# EAGLE design AD8403_SVF (EAGLE 7.2.0)
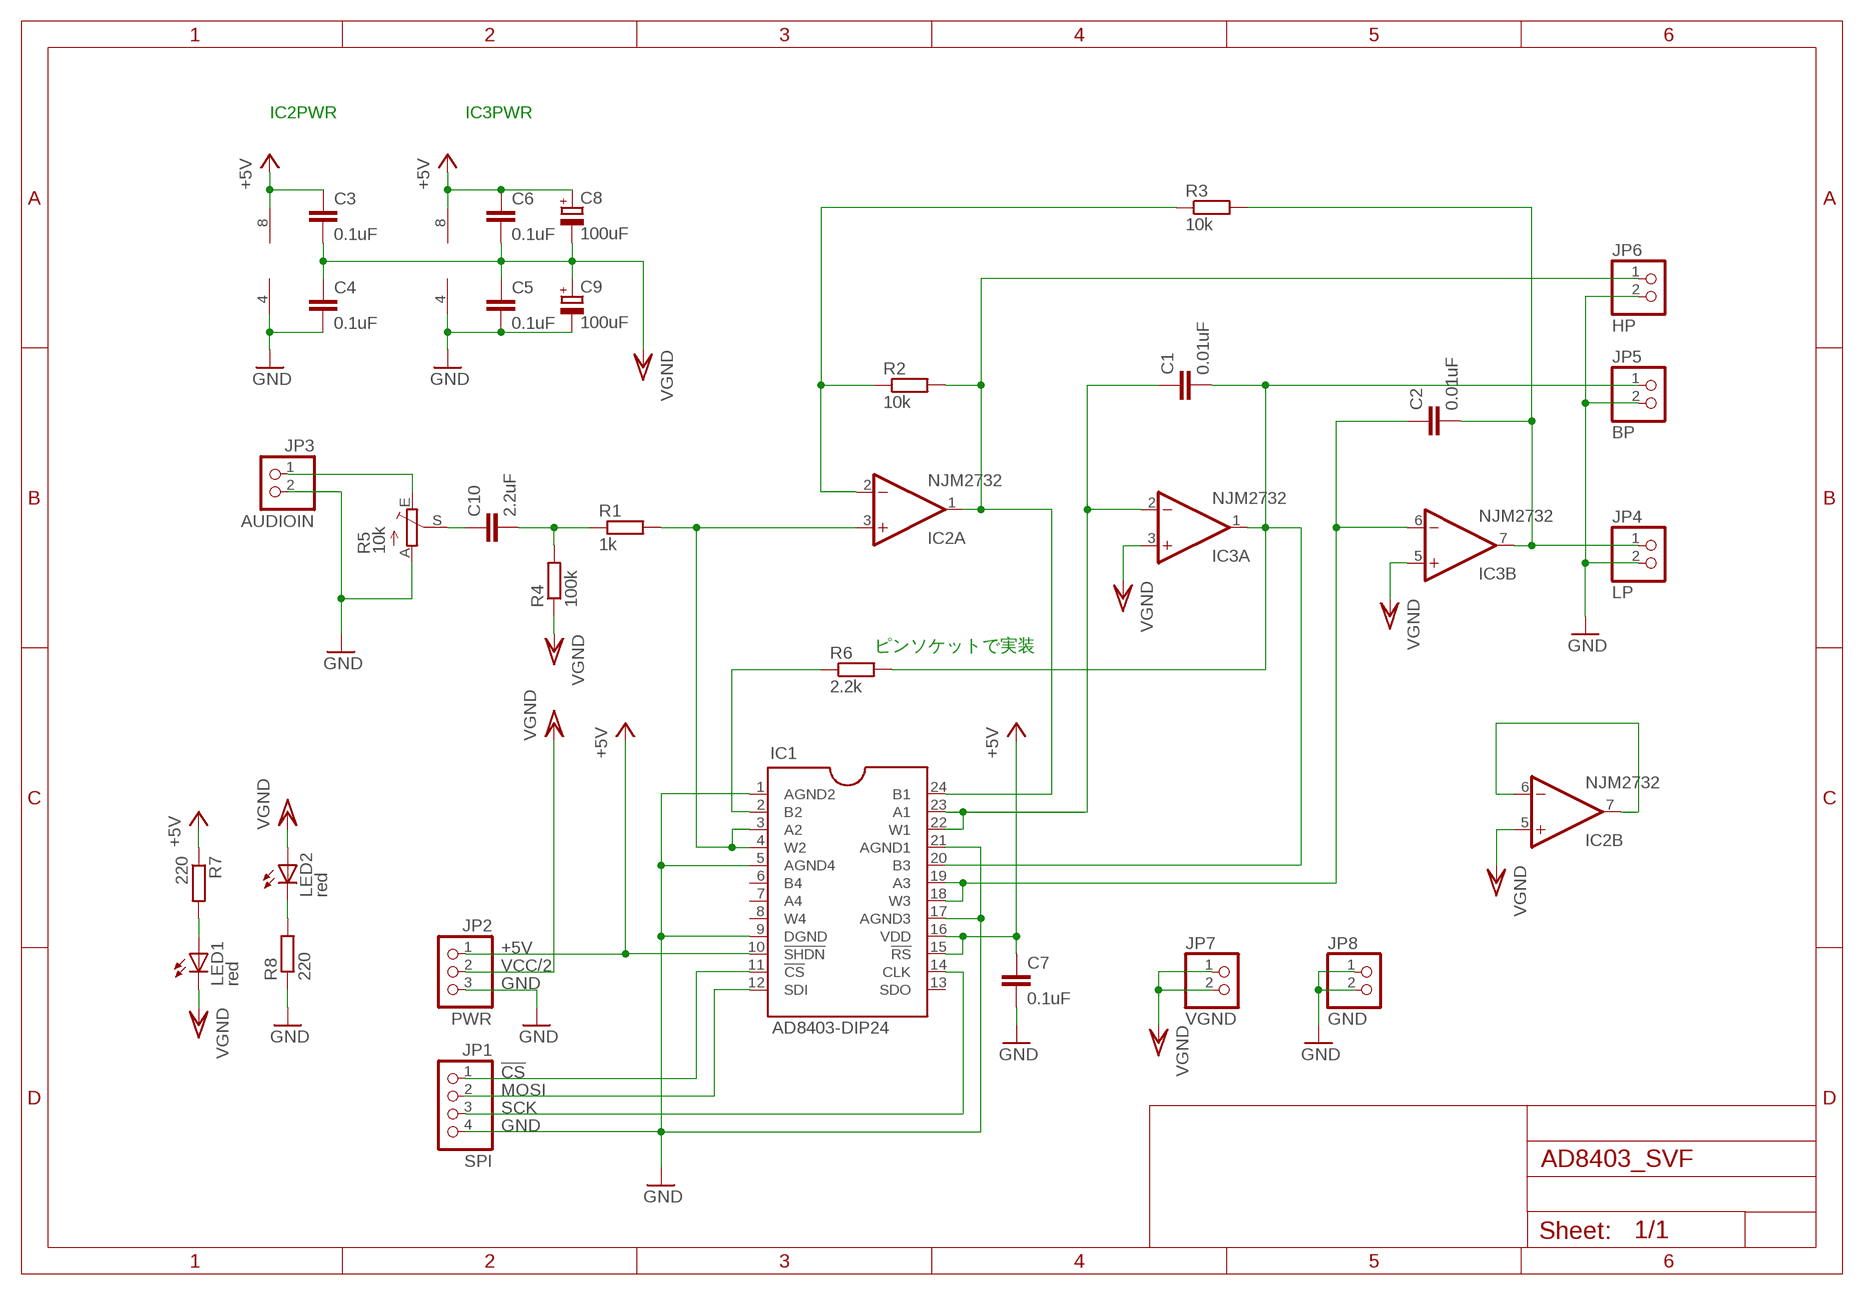
[diagram p0: schematic, sheet 1]

## Parts
C1  0.01uF  C-EU050-025X075  [C050-025X075]
C2  0.01uF  C-EU050-025X075  [C050-025X075]
C3  0.1uF  C-EU025-024X044  [C025-024X044]
C4  0.1uF  C-EU025-024X044  [C025-024X044]
C5  0.1uF  C-EU025-024X044  [C025-024X044]
C6  0.1uF  C-EU025-024X044  [C025-024X044]
C7  0.1uF  C-EU025-024X044  [C025-024X044]
C8  100uF  CPOL-EUE2.5-7  [E2,5-7]
C9  100uF  CPOL-EUE2.5-7  [E2,5-7]
C10  2.2uF  C-EU050-055X075  [C050-055X075]
IC1  AD8403-DIP24  [AD8403_DIP24]
IC2  NJM2732  LM4558N  [DIL08]
IC3  NJM2732  LM4558N  [DIL08]
JP1  SPI  PINHD-1X4  [1X04]
JP2  PWR  PINHD-1X3  [1X03]
JP3  AUDIOIN  PINHD-1X2  [1X02]
JP4  LP  PINHD-1X2  [1X02]
JP5  BP  PINHD-1X2  [1X02]
JP6  HP  PINHD-1X2  [1X02]
JP7  VGND  PINHD-1X2  [1X02]
JP8  GND  PINHD-1X2  [1X02]
LED1  red  LED3MM  [LED3MM]
LED2  red  LED3MM  [LED3MM]
R1  1k  R-EU_0207/7  [0207/7]
R2  10k  R-EU_0207/7  [0207/7]
R3  10k  R-EU_0207/7  [0207/7]
R4  100k  R-EU_0207/7  [0207/7]
R5  10k  TRIM_EU-B25P  [B25P]
R6  2.2k  R-EU_0207/7  [0207/7]
R7  220  R-EU_0204/2V  [0204V]
R8  220  R-EU_0204/2V  [0204V]

## Nets
!CS: IC1.11(!CS) JP1.1
+5V: C3.1 C6.1 C7.1 C8.+ IC1.10(!SHDN) IC1.15(!RS) IC1.16(VDD) IC2.8(P:V+) IC3.8(P:V+) JP2.1 R7.1
GND: C4.2 C5.2 C7.2 C9.- IC1.1(AGND2) IC1.5(AGND4) IC1.9(DGND) IC1.17(AGND3) IC1.21(AGND1) IC2.4(P:V-) IC3.4(P:V-) JP1.4 JP2.3 JP3.2 JP4.2 JP5.2 JP6.2 JP8.1 JP8.2 R5.A R8.1
MOSI: IC1.12(SDI) JP1.2
N$1: JP3.1 R5.E
N$2: C10.1 R5.S
N$3: IC1.3(A2) IC1.4(W2) IC2.3(A:+IN) R1.2
N$4: IC2.2(A:-IN) R2.1 R3.1
N$5: IC1.24(B1) IC2.1(A:OUT) JP6.1 R2.2
N$6: C2.1 IC1.18(W3) IC1.19(A3) IC3.6(B:-IN)
N$7: C1.1 IC1.22(W1) IC1.23(A1) IC3.2(A:-IN)
N$8: IC2.6(B:-IN) IC2.7(B:OUT)
N$9: C2.2 IC3.7(B:OUT) JP4.1 R3.2
N$10: C1.2 IC1.20(B3) IC3.1(A:OUT) JP5.1 R6.2
N$11: C10.2 R1.1 R4.2
N$12: IC1.2(B2) R6.1
N$13: LED1.A R7.2
N$14: LED2.K(C) R8.2
SCK: IC1.14(CLK) JP1.3
VCC/2: C3.2 C4.1 C5.1 C6.2 C8.- C9.+ IC2.5(B:+IN) IC3.3(A:+IN) IC3.5(B:+IN) JP2.2 JP7.1 JP7.2 LED1.K(C) LED2.A R4.1 ; supply symbol labelled VGND
Unconnected: IC1.6(B4) IC1.7(A4) IC1.8(W4) IC1.13(SDO)

## Notes on the sheet
- IC2PWR | IC3PWR
- ピンソケットで実装

## Library data of the parts
C1-C7 C10 = rcl:C-EU: CAPACITOR, European symbol
C8 C9 = rcl:CPOL-EU: POLARIZED CAPACITOR, European symbol
IC1 = mylib2:AD8403-DIP24: AD8403 with 24PIN DIP化基板
IC2 IC3 = linear:*4558: OP AMP
JP1 = pinhead:PINHD-1X4: PIN HEADER
JP2 = pinhead:PINHD-1X3: PIN HEADER
JP3-JP8 = pinhead:PINHD-1X2: PIN HEADER
LED1 LED2 = led:LED: LED OSRAM: - CHIPLED LG R971, LG N971, LY N971, LG Q971, LY Q971, LO R971, LY R971 LH N974, LH R974 LS Q976, LO Q976, LY Q976 LO Q996 - Hyper CHIPLED LW Q18S LB Q993, LB Q99A, LB R99A - SideLED LS A670, LO A670, LY A670, LG A670, LP A670 LB A673, LV A673, LT A673, LW A673 LH A674 LY A675 LS A676, LA A676, LO A676, LY A676, LW A676 LS A679, LY A679, LG A679 - Hyper Micro SIDELED® LS Y876, LA Y876, LO Y876, LY Y876 LT Y87S - SmartLED LW L88C, LW L88S LB L89C, LB L89S, LG L890 LS L89K, LO L89K, LY L89K LS L896, LA L896, LO L896, LY L896 - TOPLED LS T670, LO T670, LY T670, LG T670, LP T670 LSG T670, LSP T670, LSY T670, LOP T670, LYG T670 LG T671, LOG T671, LSG T671 LB T673, LV T673, LT T673, LW T673 LH T674 LS T676, LA T676, LO T676, LY T676, LB T676, LH T676, LSB T676, LW T676 LB T67C, LV T67C, LT T67C, LS T67K, LO T67K, LY T67K, LW E67C LS E67B, LA E67B, LO E67B, LY E67B, LB E67C, LV E67C, LT E67C LW T67C LS T679, LY T679, LG T679 LS T770, LO T770, LY T770, LG T770, LP T770 LB T773, LV T773, LT T773, LW T773 LH T774 LS E675, LA E675, LY E675, LS T675 LS T776, LA T776, LO T776, LY T776, LB T776 LHGB T686 LT T68C, LB T68C - Hyper Mini TOPLED® LB M676 - Mini TOPLED Santana® LG M470 LS M47K, LO M47K, LY M47K Source: http://www.osram.convergy.de LUXEON: - LUMILED® LXK2-PW12-R00, LXK2-PW12-S00, LXK2-PW14-U00, LXK2-PW14-V00 LXK2-PM12-R00, LXK2-PM12-S00, LXK2-PM14-U00 LXK2-PE12-Q00, LXK2-PE12-R00, LXK2-PE12-S00, LXK2-PE14-T00, LXK2-PE14-U00 LXK2-PB12-K00, LXK2-PB12-L00, LXK2-PB12-M00, LXK2-PB14-N00, LXK2-PB14-P00, LXK2-PB14-Q00 LXK2-PR12-L00, LXK2-PR12-M00, LXK2-PR14-Q00, LXK2-PR14-R00 LXK2-PD12-Q00, LXK2-PD12-R00, LXK2-PD12-S00 LXK2-PH12-R00, LXK2-PH12-S00 LXK2-PL12-P00, LXK2-PL12-Q00, LXK2-PL12-R00 Source: www.luxeon.com KINGBRIGHT: KA-3528ASYC Source: www.kingbright.com
R1-R4 R6-R8 = rcl:R-EU_: RESISTOR, European symbol
R5 = pot:TRIM_EU-: POTENTIOMETER

## Board
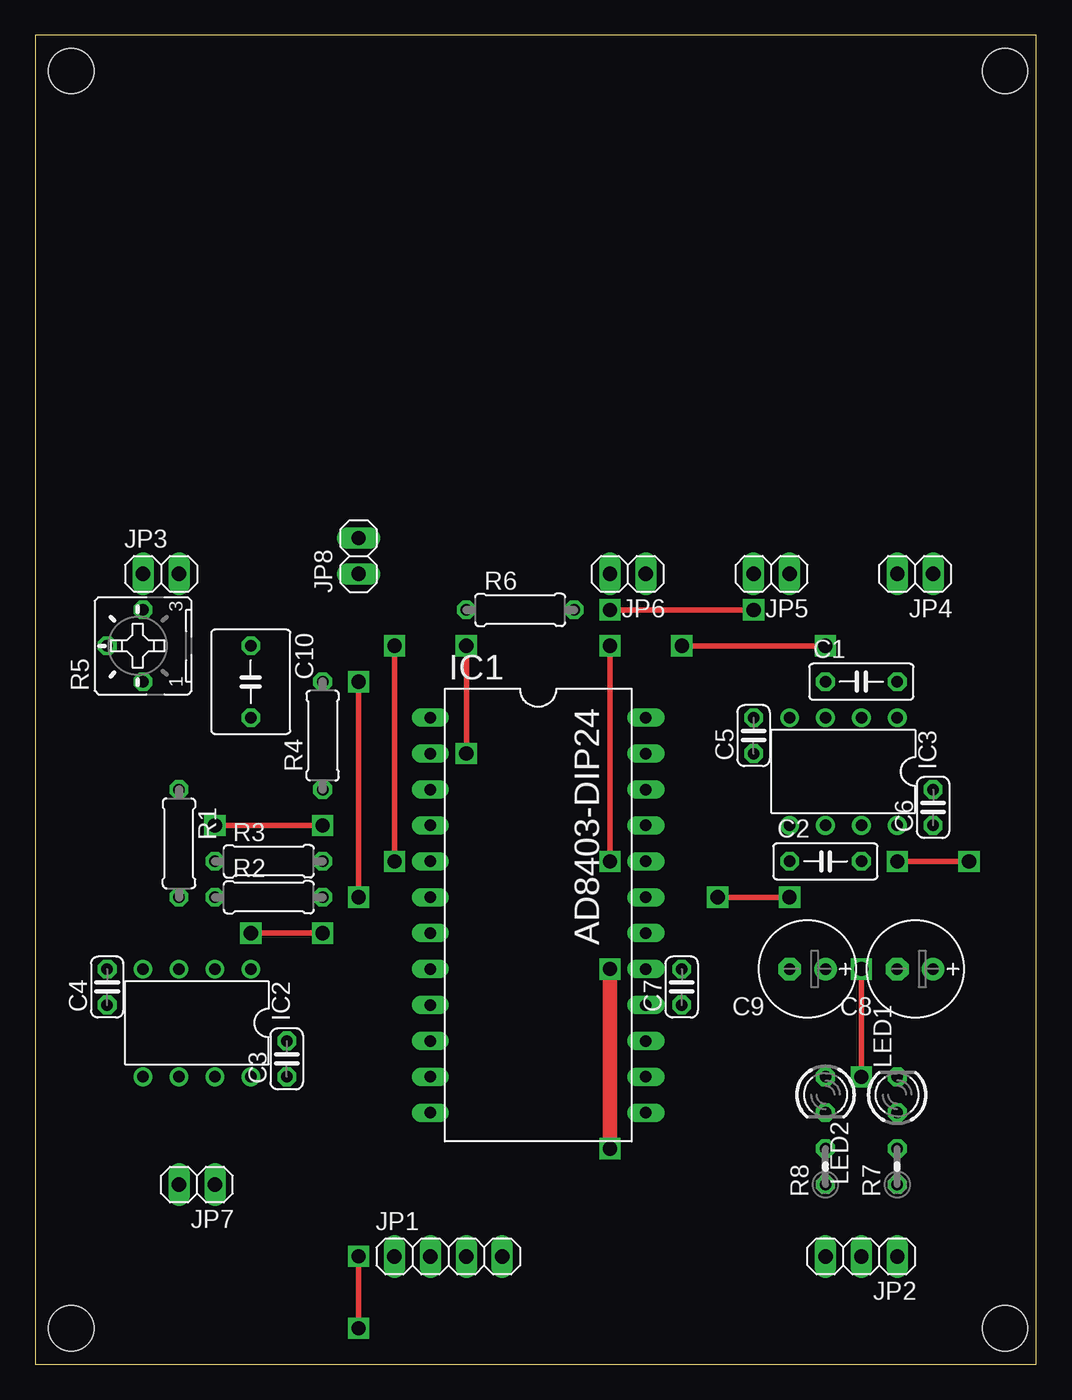
[diagram p1: board, top side]
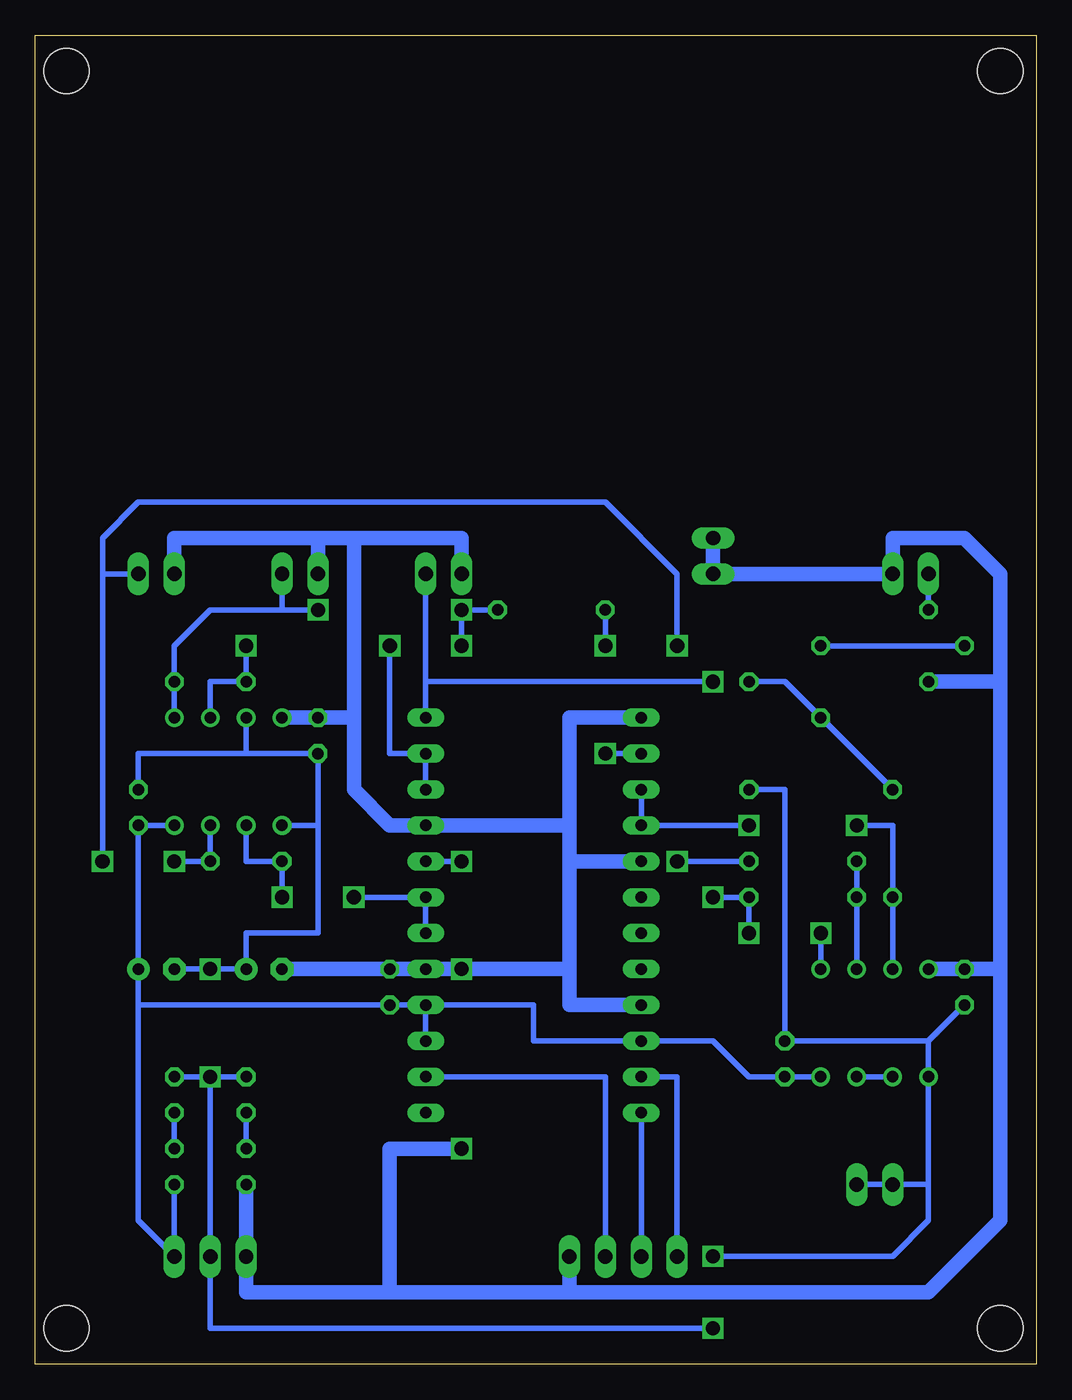
[diagram p2: board, bottom side, seen from below]

Size 70.79 x 93.97 mm. Coordinates in mm from the lower left corner, seen from the top.
Outline: 0,0 70.79,0 70.79,93.97 0,93.97 0,0
Copper layers (1*16): Top 0.035mm / dielectric 1.5mm / Bottom 0.035mm
Design rules "default": minimum track width 10mil, minimum drill 24mil, track to track 8mil, track to pad 8mil, pad to pad 8mil, via to via 8mil, smd to smd 8mil, copper to edge 40mil, drill to drill 8mil, minimum pad ring 10mil, minimum via ring 8mil, stop-mask expansion 4mil, vias tented up to drill 0mil, thermal gap 10mil
Holes 3.2 mm at 2.54,2.54 2.54,91.44 68.58,2.54 68.58,91.44

### Footprints (pad centres in the part's own frame; a part is rotated, then mirrored left to right if it is on the bottom)
C050-025X075 = drill 0.813 octagon: 1 -2.54,0; 2 2.54,0
C025-024X044 = drill 0.813 octagon: 1 -1.27,0; 2 1.27,0
E2,5-7 = drill 0.813 pad 1.6: + -1.27,0 | drill 0.813 pad 1.6 octagon: - 1.27,0
C050-055X075 = drill 0.813 octagon: 1 -2.54,0; 2 2.54,0
AD8403_DIP24 = drill 0.813 long: 1 -13.97,-7.62; 2 -11.43,-7.62; 3 -8.89,-7.62; 4 -6.35,-7.62; 5 -3.81,-7.62; 6 -1.27,-7.62; 7 1.27,-7.62; 8 3.81,-7.62; 9 6.35,-7.62; 10 8.89,-7.62; 11 11.43,-7.62; 12 13.97,-7.62; 13 13.97,7.62; 14 11.43,7.62; 15 8.89,7.62; 16 6.35,7.62; 17 3.81,7.62; 18 1.27,7.62; 19 -1.27,7.62; 20 -3.81,7.62; 21 -6.35,7.62; 22 -8.89,7.62; 23 -11.43,7.62; 24 -13.97,7.62
DIL08 = drill 0.813 pad 1.27: 1 -3.81,-3.81; 2 -1.27,-3.81; 3 1.27,-3.81; 4 3.81,-3.81; 5 3.81,3.81; 6 1.27,3.81; 7 -1.27,3.81; 8 -3.81,3.81
1X04 = drill 1.016 long: 1 -3.81,0; 2 -1.27,0; 3 1.27,0; 4 3.81,0
1X03 = drill 1.016 long: 1 -2.54,0; 2 0,0; 3 2.54,0
1X02 = drill 1.016 long: 1 -1.27,0; 2 1.27,0
LED3MM = drill 0.813 octagon: A -1.27,0; K 1.27,0
0207/7 = drill 0.813 octagon: 1 -3.81,0; 2 3.81,0
B25P = drill 0.813 octagon: A -2.54,0; E 2.54,0; S 0,2.54
0204V = drill 0.813 octagon: 1 -1.27,0; 2 1.27,0

### Placement (x,y rotation side)
C1  58.42,48.26 0 top
C2  55.88,35.56 0 top
C3  17.78,21.59 90 top
C4  5.08,26.67 90 top
C5  50.8,44.45 90 top
C6  63.5,39.37 90 top
C7  45.72,26.67 90 top
C8  62.23,27.94 180 top
C9  54.61,27.94 180 top
C10  15.24,48.26 270 top
IC1  35.56,31.75 270 top
IC2  11.43,24.13 180 top
IC3  57.15,41.91 180 top
JP1  29.21,7.62 0 top
JP2  58.42,7.62 180 top
JP3  8.89,55.88 0 top
JP4  62.23,55.88 180 top
JP5  52.07,55.88 180 top
JP6  41.91,55.88 180 top
JP7  11.43,12.7 180 top
JP8  22.86,57.15 90 top
LED1  60.96,19.05 90 top
LED2  55.88,19.05 270 top
R1  10.16,36.83 270 top
R2  16.51,33.02 0 top
R3  16.51,35.56 0 top
R4  20.32,44.45 90 top
R5  7.62,50.8 90 top
R6  34.29,53.34 0 top
R7  60.96,13.97 90 top
R8  55.88,13.97 90 top

### Tracks (layer width: path | path; a pad name or v marks a point on that pad's centre or on a via)
!CS
  Bottom 0.406: IC1.11 25.4,20.32 JP1.1
+5V
  Bottom 0.406: IC2.8 C3.1 20.32,20.32 22.86,22.86 IC1.10 35.56,22.86 35.56,25.4 IC1.16 | IC3.8 C6.1 C8.+ 63.5,25.4 | 63.5,25.4 C7.1 IC1.16 | 63.5,25.4 63.5,10.16 JP2.1 R7.1 | IC1.16 IC1.15
GND  (via drill 1)
  Top 1.016: v40.64,15.24 v40.64,27.94
  Bottom 1.016: 2.54,48.26 R5.A | IC2.4 C4.2 2.54,27.94 | JP1.4 33.02,5.08 | 33.02,5.08 7.62,5.08 2.54,10.16 2.54,27.94 | 2.54,27.94 2.54,48.26 | IC1.1 33.02,45.72 33.02,38.1 | 33.02,38.1 33.02,35.56 | 33.02,35.56 IC1.5 | IC1.9 33.02,25.4 33.02,27.94 | 33.02,27.94 33.02,35.56 | 2.54,48.26 2.54,55.88 5.08,58.42 10.16,58.42 JP3.2 JP8.1 JP8.2 | IC3.4 C5.2 48.26,45.72 | C9.- C7.2 IC1.17 v40.64,27.94 33.02,27.94 | R8.1 JP2.3 55.88,5.08 45.72,5.08 | 48.26,45.72 48.26,40.64 45.72,38.1 IC1.21 33.02,38.1 | 45.72,5.08 33.02,5.08 | 45.72,5.08 45.72,15.24 v40.64,15.24 | JP6.2 40.64,58.42 48.26,58.42 | 48.26,58.42 50.8,58.42 | 50.8,58.42 60.96,58.42 JP4.2 | JP5.2 50.8,58.42 | 48.26,45.72 48.26,58.42
MOSI
  Bottom 0.406: IC1.12 JP1.2
N$1
  Bottom 0.406: JP3.1 R5.E
N$2
  Bottom 0.406: R5.S C10.1
N$3  (via drill 1)
  Top 0.406: v20.32,38.1 v12.7,38.1
  Bottom 0.406: IC2.3 R1.2 10.16,38.1 v12.7,38.1 | v20.32,38.1 IC1.4 IC1.3
N$4
  Bottom 0.406: IC2.2 R2.1 R3.1
N$5  (via drill 1)
  Top 0.406: v15.24,30.48 v20.32,30.48 | v22.86,33.02 v22.86,48.26
  Bottom 0.406: IC2.1 v15.24,30.48 | v20.32,30.48 R2.2 v22.86,33.02 | 43.18,48.26 IC1.24 | v22.86,48.26 43.18,48.26 | JP6.1 43.18,48.26
N$6  (via drill 1)
  Top 0.406: v53.34,33.02 v48.26,33.02
  Bottom 0.406: IC3.6 55.88,35.56 C2.1 v53.34,33.02 | IC1.18 IC1.19 v48.26,33.02
N$7  (via drill 1)
  Top 0.406: v55.88,50.8 v45.72,50.8
  Bottom 0.406: v55.88,50.8 C1.1 58.42,48.26 IC3.2 | v45.72,50.8 45.72,43.18 IC1.23 IC1.22
N$8
  Bottom 0.406: IC2.6 IC2.7
N$9  (via drill 1)
  Top 0.406: v25.4,35.56 v25.4,50.8 | v60.96,35.56 v66.04,35.56
  Bottom 0.406: R3.2 v25.4,35.56 | v60.96,35.56 C2.2 IC3.7 | v66.04,35.56 66.04,55.88 | 66.04,55.88 66.04,58.42 63.5,60.96 30.48,60.96 25.4,55.88 v25.4,50.8 | JP4.1 66.04,55.88
N$10  (via drill 1)
  Top 0.406: v40.64,35.56 v40.64,50.8 | v50.8,53.34 v40.64,53.34
  Bottom 0.406: IC3.1 C1.2 60.96,50.8 58.42,53.34 53.34,53.34 | IC1.20 v40.64,35.56 | v40.64,50.8 v40.64,53.34 R6.2 | 53.34,53.34 v50.8,53.34 | JP5.1 53.34,53.34
N$11
  Bottom 0.406: R1.1 C10.2 17.78,48.26 R4.2
N$12  (via drill 1)
  Top 0.406: v30.48,43.18 v30.48,50.8
  Bottom 0.406: IC1.2 v30.48,43.18 | v30.48,50.8 R6.1
N$13
  Bottom 0.406: R7.2 LED1.A
N$14
  Bottom 0.406: LED2.K R8.2
SCK
  Bottom 0.406: IC1.14 30.48,20.32 JP1.3
VCC/2  (via drill 1)
  Top 0.406: v58.42,27.94 v58.42,20.32 | v22.86,7.62 v22.86,2.54
  Bottom 0.406: 7.62,22.86 C3.2 17.78,40.64 R4.1 | 7.62,22.86 IC2.5 7.62,12.7 | C4.1 7.62,22.86 | 55.88,43.18 63.5,43.18 C6.2 | 55.88,43.18 C5.1 50.8,38.1 | IC3.3 55.88,43.18 | IC3.5 50.8,38.1 | 50.8,38.1 50.8,30.48 55.88,30.48 C9.+ v58.42,27.94 C8.- | v22.86,2.54 58.42,2.54 JP2.2 v58.42,20.32 | v22.86,7.62 10.16,7.62 7.62,10.16 7.62,12.7 | v58.42,20.32 LED2.A | LED1.K v58.42,20.32 | JP7.1 JP7.2 7.62,12.7